# Altium schematic sheet 5VPower.SchDoc
size A4
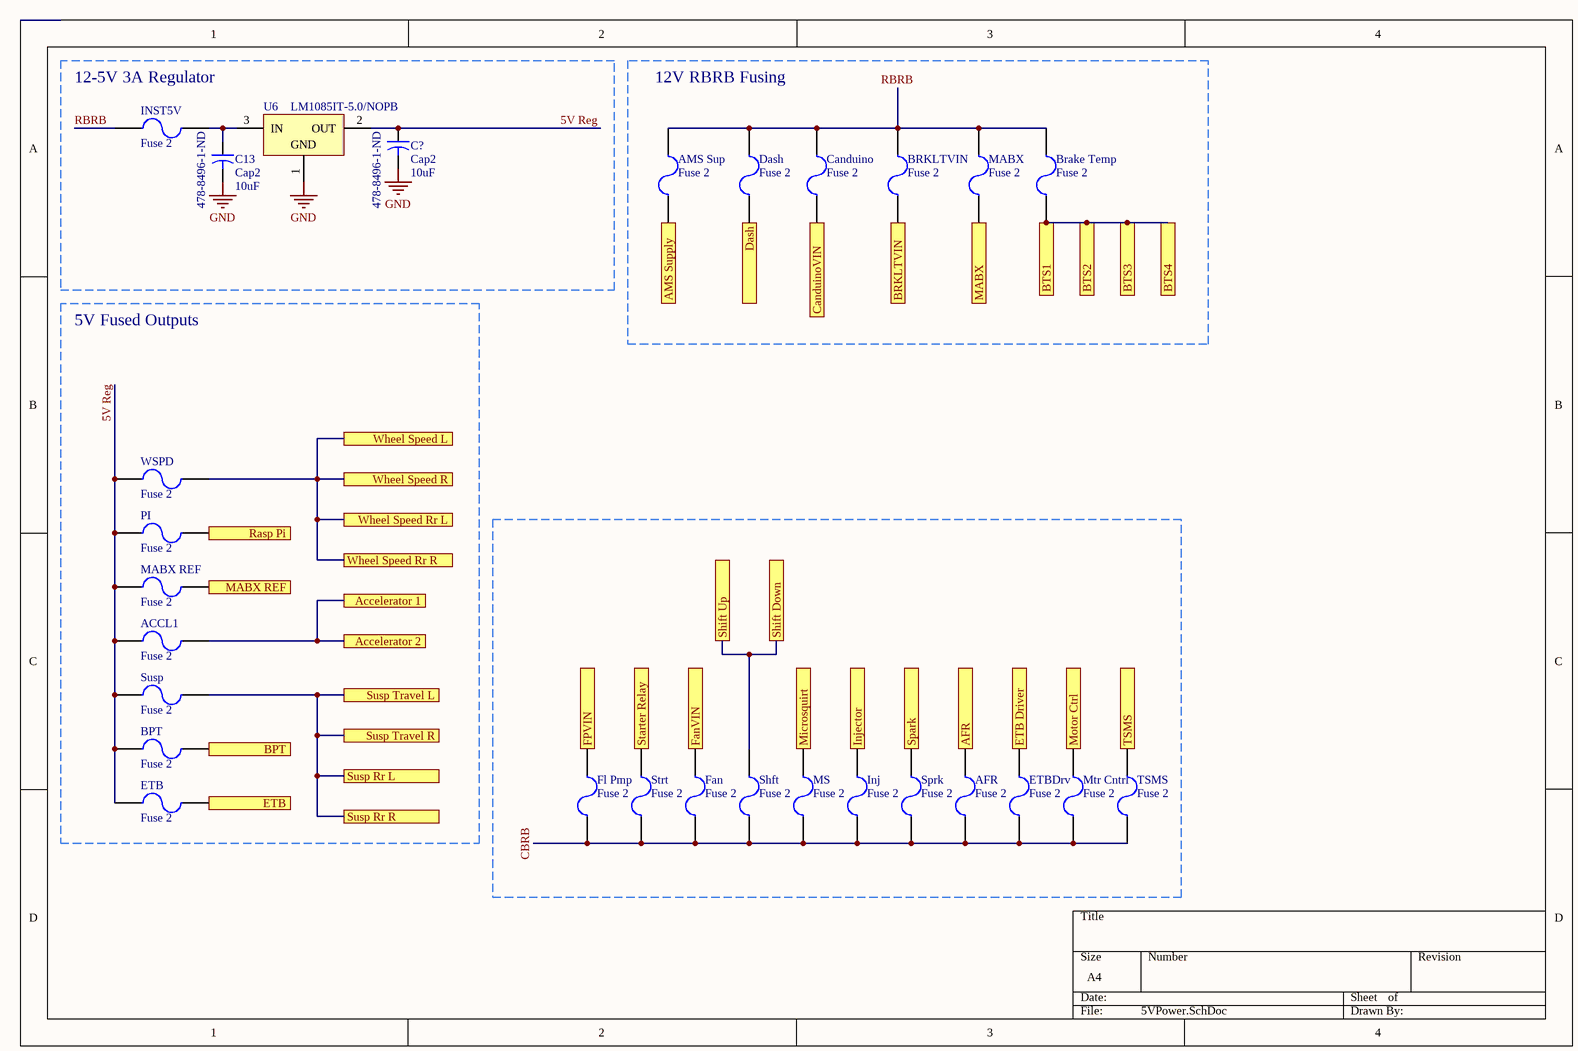
[diagram p0: 5VPower.SchDoc]

## Parts
ACCL1  Fuse 2  [FUSC4632X85N]
AFR  Fuse 2  [FUSC4632X85N]
AMS_Sup  Fuse 2  [FUSC4632X85N]
BPT  Fuse 2  [FUSC4632X85N]
Brake_Temp  Fuse 2  [FUSC4632X85N]
BRKLTVIN  Fuse 2  [FUSC4632X85N]
C13  Cap2  value 10uF  Supplier Part Number 1: 478-8496-1-ND  [C1206]
C?  Cap2  value 10uF  Supplier Part Number 1: 478-8496-1-ND  [C1206]
Canduino  Fuse 2  [FUSC4632X85N]
Dash  Fuse 2  [FUSC4632X85N]
ETB  Fuse 2  [FUSC4632X85N]
ETBDrv  Fuse 2  [FUSC4632X85N]
Fan  Fuse 2  [FUSC4632X85N]
Fl_Pmp  Fuse 2  [FUSC4632X85N]
Inj  Fuse 2  [FUSC4632X85N]
INST5V  Fuse 2  [FUSC4632X85N]
MABX  Fuse 2  [FUSC4632X85N]
MABX_REF  Fuse 2  [FUSC4632X85N]
MS  Fuse 2  [FUSC4632X85N]
Mtr_Cntrl  Fuse 2  [FUSC4632X85N]
PI  Fuse 2  [FUSC4632X85N]
Shft  Fuse 2  [FUSC4632X85N]
Sprk  Fuse 2  [FUSC4632X85N]
Strt  Fuse 2  [FUSC4632X85N]
Susp  Fuse 2  [FUSC4632X85N]
TSMS  Fuse 2  [FUSC4632X85N]
U6  LM1085IT-5.0/NOPB  [T03B]
WSPD  Fuse 2  [FUSC4632X85N]

## Blocks framed on the sheet
12-5V 3A Regulator: C13 C? INST5V U6
12V RBRB Fusing: AMS_Sup Brake_Temp BRKLTVIN Canduino Dash MABX
5V Fused Outputs: ACCL1 BPT ETB MABX_REF PI Susp WSPD

## Ports
Accelerator 1, Accelerator 2, AFR, AMS Supply, BPT, BRKLTVIN, BTS1, BTS2, BTS3, BTS4, CanduinoVIN, Dash, ETB, ETB Driver, FanVIN, FPVIN, Injector, MABX, MABX REF, Microsquirt, Motor Ctrl, Rasp Pi, Shift Down, Shift Up, Spark, Starter Relay, Susp Rr L, Susp Rr R, Susp Travel L, Susp Travel R, TSMS, Wheel Speed L, Wheel Speed R, Wheel Speed Rr L, Wheel Speed Rr R

## Nets
GND: C13.2 C?.2 U6.1(GND)
5V Reg: ACCL1.1 BPT.1 C?.1 ETB.1 MABX_REF.1 PI.1 Susp.1 U6.2(OUT) WSPD.1
Accelerator 1: ACCL1.2 ; port Accelerator 1, port Accelerator 2
AFR: AFR.2 ; port AFR
AMS Supply: AMS_Sup.1 ; port AMS Supply
BPT: BPT.2 ; port BPT
BRKLTVIN: BRKLTVIN.1 ; port BRKLTVIN
BTS1: Brake_Temp.1 ; port BTS1, port BTS2, port BTS3, port BTS4
CanduinoVIN: Canduino.1 ; port CanduinoVIN
CBRB: AFR.1 ETBDrv.1 Fan.1 Fl_Pmp.1 Inj.1 MS.1 Mtr_Cntrl.1 Shft.1 Sprk.1 Strt.1 TSMS.1
Dash: Dash.1 ; port Dash
ETB: ETB.2 ; port ETB
ETB Driver: ETBDrv.2 ; port ETB Driver
FanVIN: Fan.2 ; port FanVIN
FPVIN: Fl_Pmp.2 ; port FPVIN
Injector: Inj.2 ; port Injector
MABX: MABX.1 ; port MABX
MABX REF: MABX_REF.2 ; port MABX REF
Microsquirt: MS.2 ; port Microsquirt
Motor Ctrl: Mtr_Cntrl.2 ; port Motor Ctrl
Rasp Pi: PI.2 ; port Rasp Pi
RBRB: AMS_Sup.2 Brake_Temp.2 BRKLTVIN.2 Canduino.2 Dash.2 INST5V.2 MABX.2
Shift Down: Shft.2 ; port Shift Up, port Shift Down
Spark: Sprk.2 ; port Spark
Starter Relay: Strt.2 ; port Starter Relay
Susp Rr L: Susp.2 ; port Susp Travel L, port Susp Travel R, port Susp Rr L, port Susp Rr R
TSMS: TSMS.2 ; port TSMS
Wheel Speed L: WSPD.2 ; port Wheel Speed L, port Wheel Speed R, port Wheel Speed Rr L, port Wheel Speed Rr R
NetC13_1: C13.1 INST5V.1 U6.3(IN)

## Library data of the parts
ACCL1 AMS_Sup BPT Brake_Temp BRKLTVIN Canduino Dash ETB ETBDrv Fan Fl_Pmp Inj INST5V MABX MABX_REF MS Mtr_Cntrl PI Shft Sprk Strt Susp TSMS WSPD = Fuse 2: Fuse; part number: MF-MSMF050-2; Manufacturer: Bourns; Max Current Rating: 100A; Hold Current: 500mA; Trip Current: 1A; Power Dissipation: 800mW; Voltage Rating: 15V; Resistance: 150mR; Time to Trip: 0.15s; Approvals: UL,CSA,TUV; Published: 8-Jun-2000; LatestRevisionDate: 17-Jul-2002; LatestRevisionNote: Re-released for DXP Platform.; PackageReference: PIN-W2/E2.8; Publisher: Altium Limited; PackageDescription: Thru-Hole; 2 Leads; Supplier 1: Digi-Key; Supplier Part Number: ‎MF-MSMF050-2CT-ND; Manufacturer Part Number: MF-MSMF050-2; Stock 1: 126000; Pricing 1: 2000=0.2898, 4000=0.28463, 6000=0.27945, 10000=0.2691 (USD); Mount: Surface Mount,PCB; Case/Package: 1812; Case Code (Metric): 4532; Case Code (Imperial): 1812; Number of Terminals: 2; Contact Plating: Gold; Terminal Material: Gold; Min Operating Temperature: -40°C; Max Operating Temperature: 85°C; Packaging: Tape and Reel; Package Quantity: 2000; Operating Supply Voltage: 15V; Current Rating: 100A; Termination: SMD/SMT; Voltage Rating (DC): 15V; Length: 4.73mm; Height: 0.85mm; Width: 3.41mm; Radiation Hardening: No; REACH SVHC: No SVHC; Lead Free: Lead Free; ComponentLink1URL: https://datasheet.ciiva.com/326/mfmsmf-326354.pdf; ComponentLink1Description: https://datasheet.ciiva.com/326/mfmsmf-326354.pdf; ComponentLink2URL: https://datasheet.ciiva.com/1228/1786007-1228155.pdf; ComponentLink2Description: https://datasheet.ciiva.com/1228/1786007-1228155.pdf; ComponentLink3URL: https://datasheet.ciiva.com/16205/mfmsmf-16205994.pdf; ComponentLink3Description: https://datasheet.ciiva.com/16205/mfmsmf-16205994.pdf; ComponentLink4URL: https://datasheet.ciiva.com/34302/1164200-34302041.pdf; ComponentLink4Description: https://datasheet.ciiva.com/34302/1164200-34302041.pdf; ComponentLink5URL: https://datasheet.ciiva.com/14537/70153434-14537737.pdf; ComponentLink5Description: https://datasheet.ciiva.com/14537/70153434-14537737.pdf; ComponentLink6URL: https://datasheet.ciiva.com/46395/1695373-46395287.pdf; ComponentLink6Description: https://datasheet.ciiva.com/46395/1695373-46395287.pdf; ComponentLink7URL: https://datasheet.ciiva.com/22749/1695373-22749079.pdf; ComponentLink7Description: https://datasheet.ciiva.com/22749/1695373-22749079.pdf; ComponentLink8URL: https://datasheet.ciiva.com/32426/mf-msmf-series-eng-tds-32426126.pdf; ComponentLink8Description: https://datasheet.ciiva.com/32426/mf-msmf-series-eng-tds-32426126.pdf; ComponentLink9URL: https://datasheet.ciiva.com/4501/mfmsmf-72300-4501655.pdf; ComponentLink9Description: https://datasheet.ciiva.com/4501/mfmsmf-72300-4501655.pdf; ComponentLink10URL: https://datasheet.ciiva.com/3019/mfmsmf-3019622.pdf; ComponentLink10Description: https://datasheet.ciiva.com/3019/mfmsmf-3019622.pdf; ComponentLink11URL: https://datasheet.ciiva.com/3019/mfmsmf-3019621.pdf; ComponentLink11Description: https://datasheet.ciiva.com/3019/mfmsmf-3019621.pdf; ComponentLink12URL: https://datasheet.ciiva.com/326/mfmsmf-326356.pdf; ComponentLink12Description: https://datasheet.ciiva.com/326/mfmsmf-326356.pdf; ComponentLink13URL: https://datasheet.ciiva.com/1274/1786007-1274499.pdf; ComponentLink13Description: https://datasheet.ciiva.com/1274/1786007-1274499.pdf; ComponentLink14URL: https://datasheet.ciiva.com/326/mfmsmf-326355.pdf; ComponentLink14Description: https://datasheet.ciiva.com/326/mfmsmf-326355.pdf; ComponentLink15URL: https://datasheet.ciiva.com/1274/1786007-1274498.pdf; ComponentLink15Description: https://datasheet.ciiva.com/1274/1786007-1274498.pdf; ComponentLink16URL: https://datasheet.ciiva.com/15226/getdatasheetpartid-117168-15226886.pdf; ComponentLink16Description: https://datasheet.ciiva.com/15226/getdatasheetpartid-117168-15226886.pdf; ComponentLink17URL: https://datasheet.ciiva.com/25894/mfmsmf-25894175.pdf; ComponentLink17Description: https://datasheet.ciiva.com/25894/mfmsmf-25894175.pdf
AFR = Fuse 2: part number: MF-MSMF050-2; Manufacturer: Bourns; Max Current Rating: 100A; Hold Current: 500mA; Trip Current: 1A; Power Dissipation: 800mW; Voltage Rating: 15V; Resistance: 150mR; Time to Trip: 0.15s; Approvals: UL,CSA,TUV; Published: 8-Jun-2000; LatestRevisionDate: 17-Jul-2002; LatestRevisionNote: Re-released for DXP Platform.; PackageReference: PIN-W2/E2.8; Publisher: Altium Limited; PackageDescription: Thru-Hole; 2 Leads; Supplier 1: Digi-Key; Supplier Part Number: ‎MF-MSMF050-2CT-ND; Manufacturer Part Number: MF-MSMF050-2; Stock 1: 126000; Pricing 1: 2000=0.2898, 4000=0.28463, 6000=0.27945, 10000=0.2691 (USD); Mount: Surface Mount,PCB; Case/Package: 1812; Case Code (Metric): 4532; Case Code (Imperial): 1812; Number of Terminals: 2; Contact Plating: Gold; Terminal Material: Gold; Min Operating Temperature: -40°C; Max Operating Temperature: 85°C; Packaging: Tape and Reel; Package Quantity: 2000; Operating Supply Voltage: 15V; Current Rating: 100A; Termination: SMD/SMT; Voltage Rating (DC): 15V; Length: 4.73mm; Height: 0.85mm; Width: 3.41mm; Radiation Hardening: No; REACH SVHC: No SVHC; Lead Free: Lead Free; ComponentLink1URL: https://datasheet.ciiva.com/326/mfmsmf-326354.pdf; ComponentLink1Description: https://datasheet.ciiva.com/326/mfmsmf-326354.pdf; ComponentLink2URL: https://datasheet.ciiva.com/1228/1786007-1228155.pdf; ComponentLink2Description: https://datasheet.ciiva.com/1228/1786007-1228155.pdf; ComponentLink3URL: https://datasheet.ciiva.com/16205/mfmsmf-16205994.pdf; ComponentLink3Description: https://datasheet.ciiva.com/16205/mfmsmf-16205994.pdf; ComponentLink4URL: https://datasheet.ciiva.com/34302/1164200-34302041.pdf; ComponentLink4Description: https://datasheet.ciiva.com/34302/1164200-34302041.pdf; ComponentLink5URL: https://datasheet.ciiva.com/14537/70153434-14537737.pdf; ComponentLink5Description: https://datasheet.ciiva.com/14537/70153434-14537737.pdf; ComponentLink6URL: https://datasheet.ciiva.com/46395/1695373-46395287.pdf; ComponentLink6Description: https://datasheet.ciiva.com/46395/1695373-46395287.pdf; ComponentLink7URL: https://datasheet.ciiva.com/22749/1695373-22749079.pdf; ComponentLink7Description: https://datasheet.ciiva.com/22749/1695373-22749079.pdf; ComponentLink8URL: https://datasheet.ciiva.com/32426/mf-msmf-series-eng-tds-32426126.pdf; ComponentLink8Description: https://datasheet.ciiva.com/32426/mf-msmf-series-eng-tds-32426126.pdf; ComponentLink9URL: https://datasheet.ciiva.com/4501/mfmsmf-72300-4501655.pdf; ComponentLink9Description: https://datasheet.ciiva.com/4501/mfmsmf-72300-4501655.pdf; ComponentLink10URL: https://datasheet.ciiva.com/3019/mfmsmf-3019622.pdf; ComponentLink10Description: https://datasheet.ciiva.com/3019/mfmsmf-3019622.pdf; ComponentLink11URL: https://datasheet.ciiva.com/3019/mfmsmf-3019621.pdf; ComponentLink11Description: https://datasheet.ciiva.com/3019/mfmsmf-3019621.pdf; ComponentLink12URL: https://datasheet.ciiva.com/326/mfmsmf-326356.pdf; ComponentLink12Description: https://datasheet.ciiva.com/326/mfmsmf-326356.pdf; ComponentLink13URL: https://datasheet.ciiva.com/1274/1786007-1274499.pdf; ComponentLink13Description: https://datasheet.ciiva.com/1274/1786007-1274499.pdf; ComponentLink14URL: https://datasheet.ciiva.com/326/mfmsmf-326355.pdf; ComponentLink14Description: https://datasheet.ciiva.com/326/mfmsmf-326355.pdf; ComponentLink15URL: https://datasheet.ciiva.com/1274/1786007-1274498.pdf; ComponentLink15Description: https://datasheet.ciiva.com/1274/1786007-1274498.pdf; ComponentLink16URL: https://datasheet.ciiva.com/15226/getdatasheetpartid-117168-15226886.pdf; ComponentLink16Description: https://datasheet.ciiva.com/15226/getdatasheetpartid-117168-15226886.pdf; ComponentLink17URL: https://datasheet.ciiva.com/25894/mfmsmf-25894175.pdf; ComponentLink17Description: https://datasheet.ciiva.com/25894/mfmsmf-25894175.pdf
C13 C? = Cap2: Capacitor. Ceramic 10uF 50V rating recommended, place close to pin; Published: 23-Sep-2002; PackageReference: CAPR5-4X5; Publisher: Altium Limited; PackageDescription: Capacitor; 2 Leads; Supplier 1: Digi-Key
U6 = LM1085IT-5.0/NOPB: 3A Low Dropout Positive Regulators, 3-pin TO-220, Pb-Free; Manufacturer: National Semiconductor; PackageTopMarking: NSUZXYTTE#*LM1085*IT-5.0; PowerWise: N; CompType: LDO IC; High-Reliability: Y; DatasheetVersion: Jun-2005; PackageVersion: revL, Jan-1992; PackageReference: T03B; PackageDescription: TO-220, Molded, 3 Lead, Straight; PartNumber: LM1085IT-5.0/NOPB; RoHS: Y; PinCount: 3; ComponentLink1Description: Manufacturer URL; ComponentLink1URL: http://www.national.com/; ComponentLink2Description: LM1085 Datasheet; ComponentLink2URL: http://www.national.com/ds/LM/LM1085.pdf; ComponentLink3Description: LM1085 Web Page; ComponentLink3URL: http://www.national.com/pf/LM/LM1085.html; ComponentLink4Description: T03B Package Page; ComponentLink4URL: http://www.national.com/packaging/folders/t03b.html